# EAGLE design digidice_TI (EAGLE 6.2)
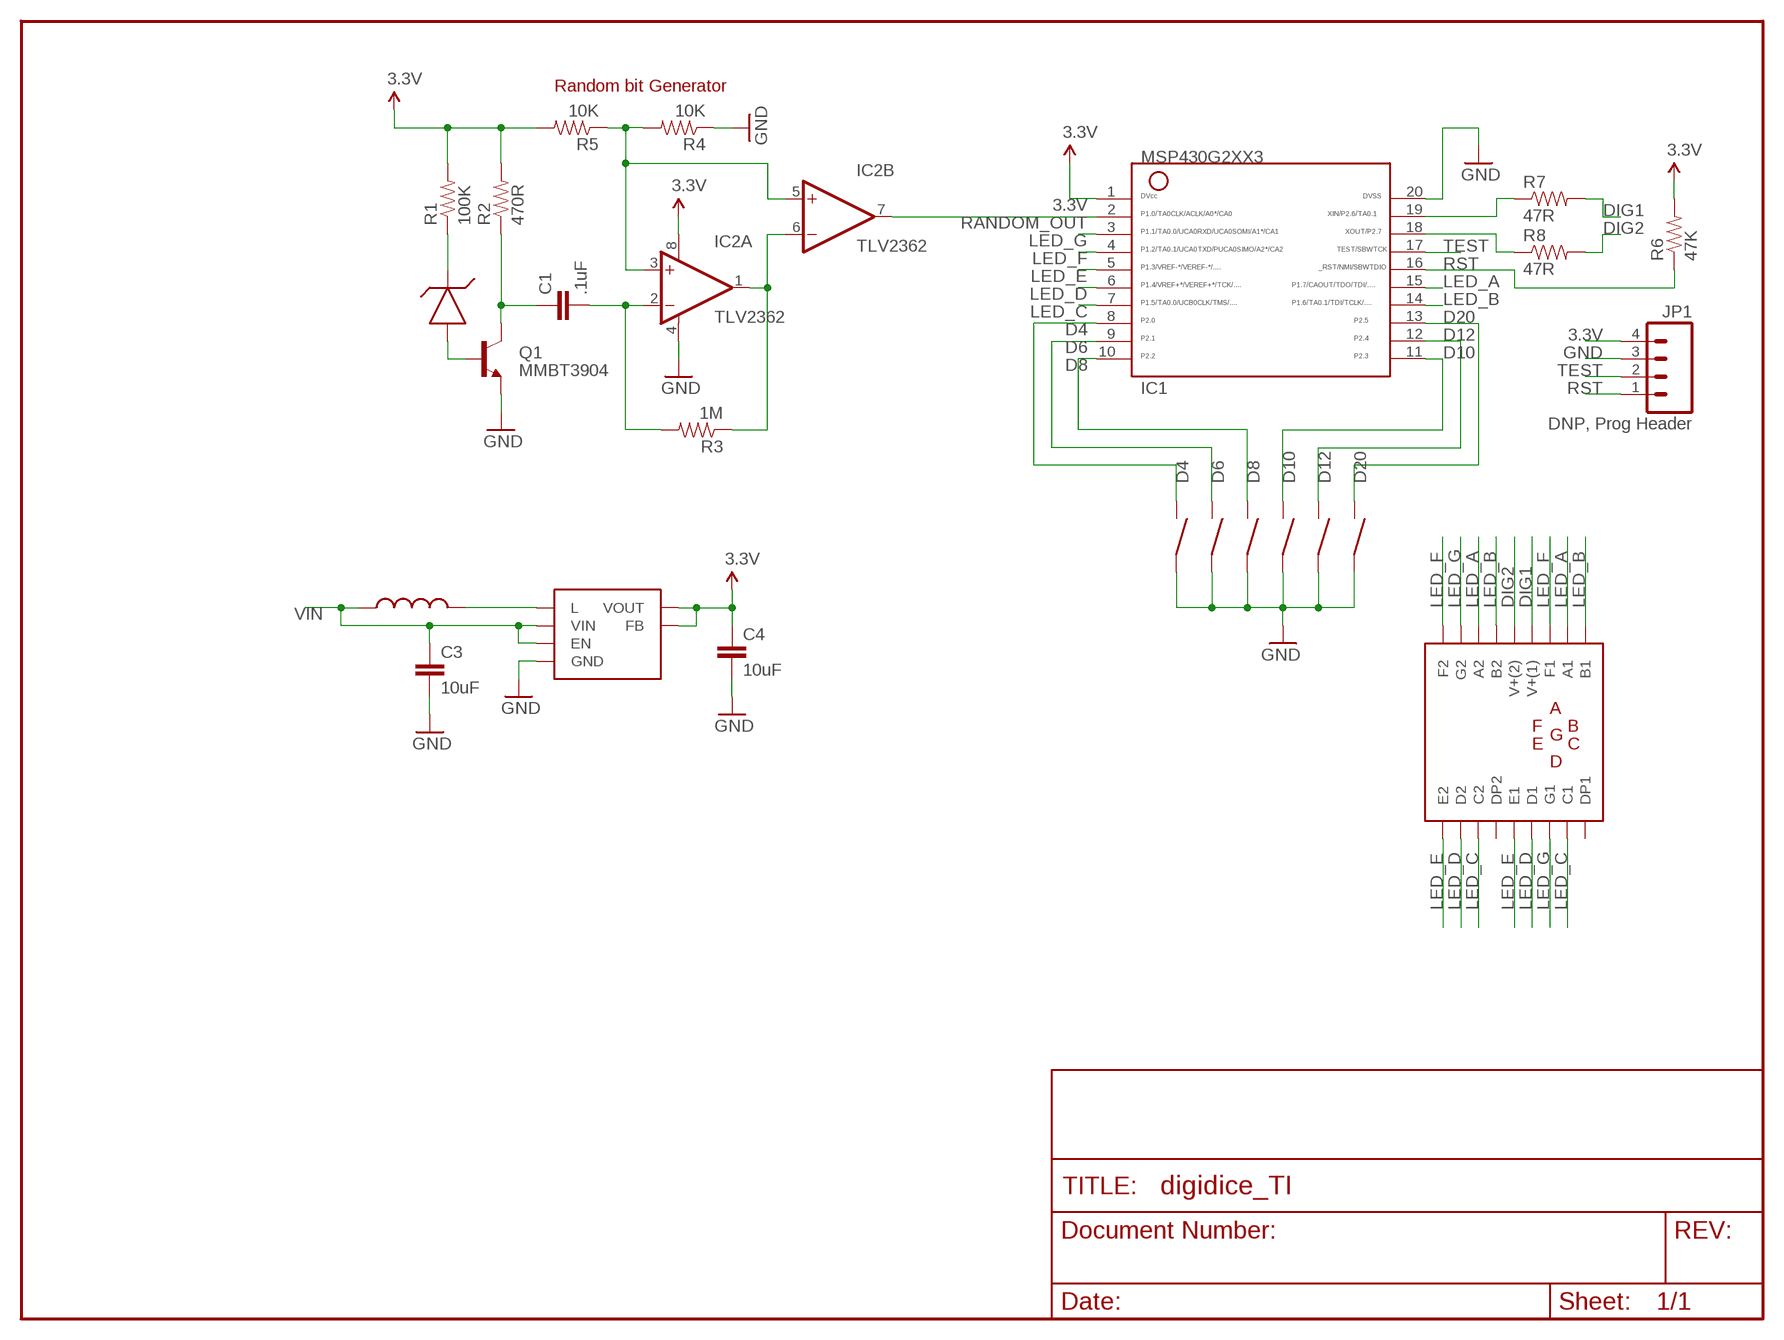
[diagram p0: schematic, sheet 1]

## Parts
C1  .1uF  CAP0402-CAP  [0402-CAP]
C3  10uF  CAP0603-CAP  [0603-CAP]
C4  10uF  CAP0603-CAP  [0603-CAP]
IC1  MSP430G2203IPW20  G2XX3---PW20  [PW20]
IC2  TLV2362  OPA2340E  [MSOP08]
IC3  TLV61225  [SOT-363]
JP1  DNP, Prog Header  M041.27MM  [1X04-1.27MM]
L1  PFL2015-472ML  INDUCTORPFL2015  [COILCRAFT-PFL2015]
Q1  MMBT3904  TRANSISTOR_NPNSOT23  [SOT23]
R1  100K  RESISTOR0402-RES  [0402-RES]
R2  470R  RESISTOR0402-RES  [0402-RES]
R3  1M  RESISTOR0402-RES  [0402-RES]
R4  10K  RESISTOR0402-RES  [0402-RES]
R5  10K  RESISTOR0402-RES  [0402-RES]
R6  47K  RESISTOR0402-RES  [0402-RES]
R7  47R  RESISTOR  [0805]
R8  47R  RESISTOR  [0805]
SW1  SPST_SWITCH  [EG2513-ND]
SW2  SPST_SWITCH  [EG2513-ND]
SW3  SPST_SWITCH  [EG2513-ND]
SW4  SPST_SWITCH  [EG2513-ND]
SW5  SPST_SWITCH  [EG2513-ND]
SW6  SPST_SWITCH  [EG2513-ND]
U$1  ZXRE1004FFTA  [SOT23]
U$2  2DIGIT_7SEGMENT  [HDSP-521E]

## Nets
3.3V: C4.1 IC1.1 IC2.8(A:V+) IC3.P$2(FB) IC3.P$4(VOUT) JP1.4 R1.2 R2.2 R5.2 R6.2
D4: IC1.8 SW6.P$2
D6: IC1.9 SW5.P$2
D8: IC1.10 SW4.P$2
D10: IC1.11 SW3.P$2
D12: IC1.12 SW2.P$2
D20: IC1.13 SW1.P$2
DIG1: R7.2 U$2.P$13(V+(1))
DIG2: R8.2 U$2.P$14(V+(2))
GND: C3.2 C4.2 IC1.20 IC2.4(A:V-) IC3.P$3(GND) JP1.3 Q1.2(E) R4.1 SW1.P$1 SW2.P$1 SW3.P$1 SW4.P$1 SW5.P$1 SW6.P$1
LED_A: IC1.15 U$2.P$11(A1) U$2.P$16(A2)
LED_B: IC1.14 U$2.P$10(B1) U$2.P$15(B2)
LED_C: IC1.7 U$2.P$3(C2) U$2.P$8(C1)
LED_D: IC1.6 U$2.P$2(D2) U$2.P$6(D1)
LED_E: IC1.5 U$2.P$1(E2) U$2.P$5(E1)
LED_F: IC1.4 U$2.P$12(F1) U$2.P$18(F2)
LED_G: IC1.3 U$2.P$7(G1) U$2.P$17(G2)
N$1: Q1.1(B) U$1.2(A)
N$2: C1.1 Q1.3(C) R2.1
N$3: R1.1 U$1.1(K)
N$4: C1.2 IC2.2(A:-IN) R3.2
N$5: IC2.1(A:OUT) IC2.6(B:-IN) R3.1
N$6: IC2.3(A:+IN) IC2.5(B:+IN) R4.2 R5.1
N$7: IC1.19 R7.1
N$10: IC1.18 R8.1
N$17: IC3.P$5(L) L1.P$2
RANDOM_OUT: IC1.2 IC2.7(B:OUT)
RST: IC1.16 JP1.1 R6.1
TEST: IC1.17 JP1.2
VIN: C3.1 IC3.P$1(VIN) IC3.P$6(EN) L1.P$1
Unconnected: U$2.P$4(DP2) U$2.P$9(DP1)

## Notes on the sheet
- Random bit Generator

## Library data of the parts
C1 C3 C4 = KippKitts:CAP: Capacitor Standard 0603 ceramic capacitor, and 0.1" leaded capacitor.
IC1 = TI_MSP430_v16:G2XX3---PW20: MSP430G2XX1 TSSOP (PW) 20 Pin Package
IC2 = burr-brown:OPA2340: Single-Supply, Rail-to-Rail Operational Amplifiers MicroAmplifier(TM) Series; Product Folder:OPA2340; MF: TEXAS INSTRUMENTS; MPN: OPA2340EA/250; OC_FARNELL: 1101540; OC_NEWARK: 36K7580
IC3 = KippKitts:TLV61225
JP1 = SparkFun:M04: Header 4 Standard 4-pin 0.1" header. Use with straight break away headers (SKU : PRT-00116), right angle break away headers (PRT-00553), swiss pins (PRT-00743), machine pins (PRT-00117), and female headers (PRT-00115). Molex polarized connector foot print use with SKU : PRT-08231 with associated crimp pins and housings. 1MM SMD Version SKU: PRT-10208
L1 = KippKitts:INDUCTOR
Q1 = SparkFun:TRANSISTOR_NPN: Transistor NPN BJT configuration in SOT23 package. MMBT2222 is the common NPN we use. Double check BCE configuration again layout.
R1-R8 = KippKitts:RESISTOR: Resistor Basic schematic elements and footprints for 0603, 1206, and PTH 1/10th watt (small) resistors.
SW1-SW6 = hjohnson_library:SPST_SWITCH
U$1 = hjohnson_library:ZXRE1004FFTA
U$2 = hjohnson_library:2DIGIT_7SEGMENT

## Board
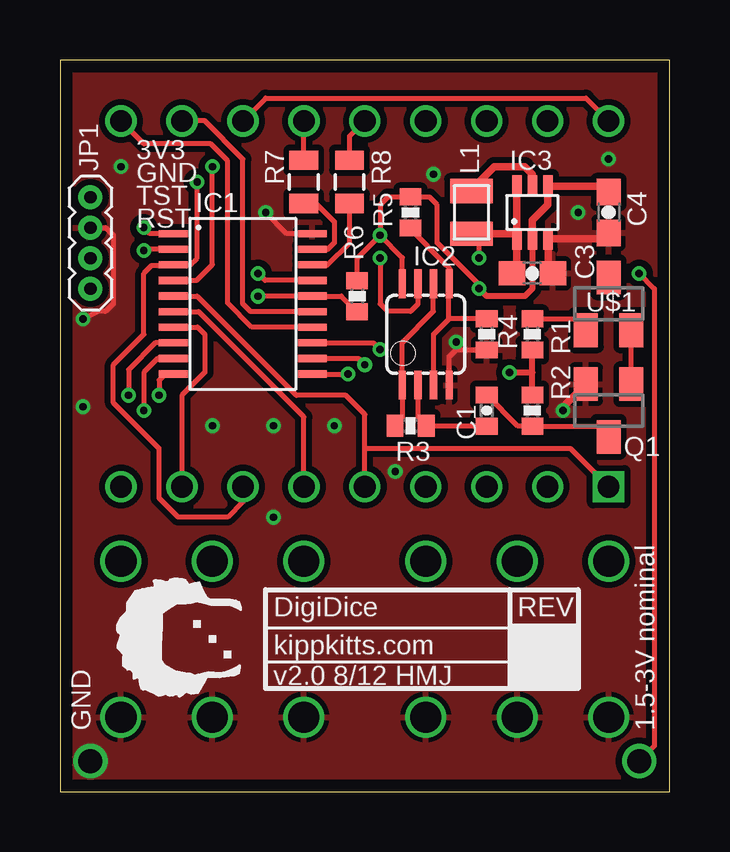
[diagram p1: board, top side]
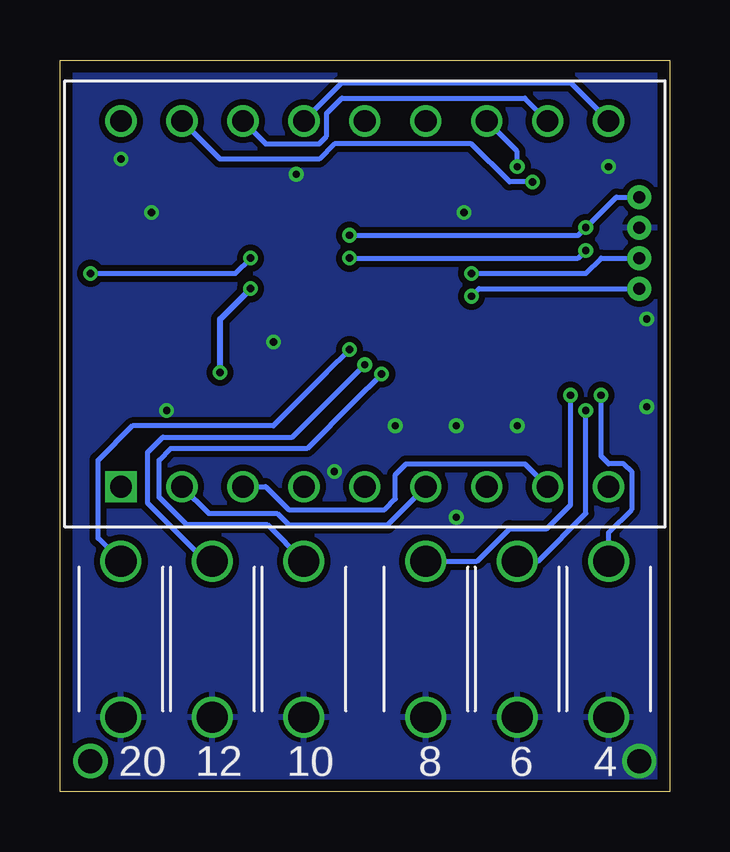
[diagram p2: board, bottom side, seen from below]

Size 25.4 x 30.48 mm. Coordinates in mm from the lower left corner, seen from the top.
Outline: 0,30.48 0,0 25.4,0 25.4,30.48 0,30.48
Copper layers (1*16): Top 0.035mm / dielectric 1.5mm / Bottom 0.035mm
Design rules: minimum track width 6mil, minimum drill 12mil, track to track 6mil, track to pad 6mil, pad to pad 6mil, via to via 6mil, smd to smd 6mil, copper to edge 20mil, drill to drill 8mil, minimum pad ring 8mil, minimum via ring 6mil, stop-mask expansion 3mil, vias tented up to drill 0mil, thermal gap 8mil

### Footprints (pad centres in the part's own frame; a part is rotated, then mirrored left to right if it is on the bottom)
0402-CAP = smd 0.7 x 0.9: 1 -0.65,0; 2 0.65,0
0603-CAP = smd 1.1 x 1: 1 -0.85,0; 2 0.85,0
PW20 = smd 0.3 x 1.2: 1 -2.925,-2.9; 2 -2.275,-2.9; 3 -1.625,-2.9; 4 -0.975,-2.9; 5 -0.325,-2.9; 6 0.325,-2.9; 7 0.975,-2.9; 8 1.625,-2.9; 9 2.275,-2.9; 10 2.925,-2.9; 11 2.925,2.9; 12 2.275,2.9; 13 1.625,2.9; 14 0.975,2.9; 15 0.325,2.9; 16 -0.325,2.9; 17 -0.975,2.9; 18 -1.625,2.9; 19 -2.275,2.9; 20 -2.925,2.9
MSOP08 = smd 0.3 x 1.2: 1 -0.976,-2.113; 2 -0.326,-2.113; 3 0.324,-2.113; 4 0.974,-2.113; 5 0.974,2.112; 6 0.324,2.112; 7 -0.326,2.112; 8 -0.976,2.112
SOT-363 = smd 0.4 x 0.9: P$1 -0.65,-1.1; P$2 0,-1.1; P$3 0.65,-1.1; P$4 0.65,1.1; P$5 0,1.1; P$6 -0.65,1.1
1X04-1.27MM = drill 0.508 pad 1: 1 0,0; 2 1.27,0; 3 2.54,0; 4 3.81,0
COILCRAFT-PFL2015 = smd 1.016 x 1.778: P$1 -0.889,0; P$2 0.889,0
SOT23 = smd 1 x 1.4: 1 -0.95,-1.1; 2 0.95,-1.1; 3 0,1.1
0402-RES = smd 0.7 x 0.9: 1 -0.65,0; 2 0.65,0
0805 = smd 0.8 x 1.2: 1 -0.9,0; 2 0.9,0
EG2513-ND = drill 1.3: P$1 -3.25,0; P$2 3.25,0
HDSP-521E = drill 0.9 square: P$1 -10.16,-7.62 | drill 0.9: P$2 -7.62,-7.62; P$3 -5.08,-7.62; P$4 -2.54,-7.62; P$5 0,-7.62; P$6 2.54,-7.62; P$7 5.08,-7.62; P$8 7.62,-7.62; P$9 10.16,-7.62; P$10 10.16,7.62; P$11 7.62,7.62; P$12 5.08,7.62; P$13 2.54,7.62; P$14 0,7.62; P$15 -2.54,7.62; P$16 -5.08,7.62; P$17 -7.62,7.62; P$18 -10.16,7.62

### Placement (x,y rotation side)
C1  17.78,15.88 270 top
C3  19.68,21.59 0 top
C4  22.86,24.13 270 top
IC1  7.62,20.32 270 top
IC2  15.24,19.05 0 top
IC3  19.68,24.13 0 top
JP1  1.27,20.95 90 top
L1  17.14,24.13 90 top
Q1  22.86,15.88 180 top
R1  19.68,19.05 270 top
R2  19.68,15.88 90 top
R3  14.61,15.24 0 top
R4  17.78,19.05 90 top
R5  14.61,24.13 90 top
R6  12.38,20.64 90 top
R7  10.16,25.4 90 top
R8  12.06,25.4 90 top
SW1  22.86,6.35 90 bottom
SW2  19.05,6.35 90 bottom
SW3  15.24,6.35 90 bottom
SW4  10.16,6.35 90 bottom
SW5  6.35,6.35 90 bottom
SW6  2.54,6.35 90 bottom
U$1  22.86,20.32 0 top
U$2  12.7,20.32 0 bottom
U$3  [TOP_DOCU_5MM]  8.26,3.17 90 top

### Tracks (layer width: path | path; a pad name or v marks a point on that pad's centre or on a via)
3.3V  (via drill 0.3)
  Top 0.203: IC1.1 3.74,23.25 v3.49,23.5 | v13.35,23.19 v13.34,23.18 | R6.2 12.38,22.23 v13.34,23.18 | IC2.8 14.26,22.25 v13.34,23.18 | v13.34,23.18 13.34,24.45 13.65,24.77 14.59,24.77 R5.2 14.62,24.77 15.4,24.77 15.72,24.45 15.72,22.86 17.46,21.11 v17.46,20.95
  Top 0.254: IC3.P$2 19.68,20.95 19.37,20.64 17.78,20.64 v17.46,20.95 | R2.2 19.68,17.46 | 19.68,17.46 R1.2 | v18.73,17.46 19.68,17.46
  Top 0.305: IC3.P$2 19.68,23.81 20.32,24.45 20.32,25.21 IC3.P$4 22.54,25.23 C4.1
  Bottom 0.203: v13.34,23.18 3.81,23.18 v3.49,23.5 2.22,24.77 JP1.4
  Bottom 0.254: v18.73,17.46 18.73,19.68 v17.46,20.95
D4  (via drill 0.3)
  Top 0.203: IC1.8 3.97,18.7 2.86,17.58 v2.86,16.51
  Bottom 0.203: SW6.P$2 2.54,10.79 1.59,11.75 1.59,13.34 1.91,13.65 2.54,13.65 2.86,13.97 v2.86,16.51
D6  (via drill 0.3)
  Top 0.203: IC1.9 4.08,18.05 3.49,17.46 v3.49,15.88
  Bottom 0.203: SW5.P$2 5.48,9.6 3.49,11.59 v3.49,15.88
D8  (via drill 0.3)
  Top 0.203: IC1.10 4.38,17.39 4.13,17.14 v4.13,16.51
  Bottom 0.203: v4.13,16.51 4.13,11.94 5.11,10.95 6.67,10.95 8.02,9.6 SW4.P$2
D10  (via drill 0.3)
  Top 0.203: IC1.11 v12,17.39
  Bottom 0.203: SW3.P$2 16.75,11.11 20.13,11.11 21.27,12.26 21.27,13.81 20.8,14.29 15.11,14.29 13.18,16.22 v12,17.39
D12  (via drill 0.3)
  Top 0.203: IC1.12 12.44,18.05 v12.7,17.78
  Bottom 0.203: v12.7,17.78 13.65,16.83 15.72,14.76 21.11,14.76 21.75,14.13 21.75,12.02 19.33,9.6 SW2.P$2
D20  (via drill 0.3)
  Top 0.203: IC1.13 13.05,18.7 v13.34,18.41
  Bottom 0.203: v13.34,18.41 14.29,17.46 16.51,15.24 22.38,15.24 23.81,13.81 23.81,10.55 SW1.P$2
DIG1
  Top 0.203: R7.2 U$2.P$13
DIG2
  Top 0.203: R8.2 12.06,27.3 U$2.P$14
GND  (via drill 0.3, 1 pad 1.42)
  Top 0.203: IC2.4 16.21,18.12 16.51,18.41 17.77,18.41 R4.1 | JP1.3 1.91,23.5 2.22,23.18 2.22,20.32 1.91,20 1.59,20 v0.95,19.68 | IC1.20 9.46,23.25 v8.57,24.13
  Top 0.305: C3.2 20.34,21.84 IC3.P$3 22.66,23.03 C4.2 | v20.95,15.88 20.95,16.02 Q1.2
  other vias: 1.27,1.27 11.43,15.24 16.51,18.73 0.95,16.03 6.35,15.24 8.89,11.43 21.59,24.13 15.56,25.72 2.54,26.04 22.86,26.35 13.97,13.34 8.89,15.24
  pour Bottom (isolate 0.254): -2.54,33.02 27.94,33.02 27.94,-2.54 -2.54,-2.54
  pour Top (isolate 0.254): -1.27,31.75 -1.27,-1.27 26.67,-1.27 26.67,31.75
LED_A
  Top 0.203: IC1.15 7.95,20 7.62,20.32 7.62,26.35 6.03,27.94 U$2.P$11
  Bottom 0.203: U$2.P$16 16.83,26.99 14.61,26.99 14.29,27.3 14.29,28.26 13.65,28.89 6.03,28.89 U$2.P$11
LED_B
  Top 0.203: IC1.14 8,19.34 6.99,20.36 6.99,26.28 6.28,26.99 3.49,26.99 U$2.P$10
  Bottom 0.203: U$2.P$15 13.65,29.53 4.13,29.53 U$2.P$10
LED_C
  Top 0.203: U$2.P$8 5.08,16.51 6.03,17.46 6.03,19.05 5.74,19.34 IC1.7
  Bottom 0.203: U$2.P$8 6.03,13.65 10.98,13.65 11.43,13.2 11.43,12.2 11.88,11.75 15.88,11.75 16.83,12.7 U$2.P$3
LED_D
  Top 0.203: IC1.6 5.78,20 10.16,15.61 U$2.P$6
  Bottom 0.203: U$2.P$2 19.21,11.59 16.35,11.59 15.88,11.11 11.75,11.11 U$2.P$6
LED_E
  Top 0.203: IC1.5 5.71,20.64 7.3,19.05 9.84,16.51 11.91,16.51 12.7,15.72 12.7,14.29 | U$2.P$1 21.27,14.29 12.7,14.29 | U$2.P$5 12.7,14.29
LED_F  (via drill 0.3)
  Top 0.203: IC1.4 5.69,21.3 6.35,21.95 v6.35,26.04 | U$2.P$18 21.91,28.89 8.57,28.89 U$2.P$12
  Bottom 0.203: v6.35,26.04 6.35,26.67 U$2.P$12
LED_G  (via drill 0.3)
  Top 0.203: U$2.P$7 7.62,12.06 6.99,11.43 4.92,11.43 4.13,12.22 4.13,14.29 2.22,16.19 2.22,17.78 3.49,19.05 3.49,21.59 3.81,21.91 4.68,21.91 IC1.3 5.43,21.95 5.71,22.23 v5.71,25.4
  Bottom 0.203: v5.71,25.4 6.67,25.4 8.26,26.99 13.97,26.99 14.61,26.35 18.73,26.35 U$2.P$17
N$1
  Top 0.203: Q1.1 U$1.2
N$2
  Top 0.203: 22.68,14.59 Q1.3 22.41,15.22 R2.1 19.08,15.22 C1.1
N$3
  Top 0.203: R1.1 21.91,19.7 U$1.1
N$4
  Top 0.203: IC2.2 14.91,15.58 R3.2 17.77,15.24 C1.2
N$5
  Top 0.203: IC2.6 15.56,20 14.26,18.71 IC2.1 14.26,15.55 R3.1
N$6
  Top 0.203: IC2.3 15.56,19.06 16.19,19.68 | 16.19,19.68 16.19,21.14 IC2.5 16.24,21.18 16.24,21.8 16,22.04 14.61,23.43 R5.1 | R4.2 16.21,19.7 16.19,19.68
N$7
  Top 0.203: R7.1 10.67,24.5 11.43,23.74 11.43,22.86 11.16,22.59 IC1.19
N$10
  Top 0.203: IC1.18 11.14,21.95 12.06,22.87 R8.1
N$17
  Top 0.305: L1.P$2 17.14,25.08 18.1,26.04 19.37,26.04 19.68,25.72 IC3.P$5
RANDOM_OUT  (via drill 0.3)
  Top 0.203: IC1.2 3.54,22.59 v3.49,22.54 | IC2.7 14.91,20.31 14.61,20 13.65,20 13.34,20.32 v13.34,22.23
  Bottom 0.203: v13.34,22.23 3.81,22.23 v3.49,22.54
RST  (via drill 0.3)
  Top 0.203: R6.1 11.72,20.64 IC1.16 v8.26,20.64
  Bottom 0.203: JP1.1 7.94,20.95 v8.26,20.64
TEST  (via drill 0.3)
  Top 0.203: IC1.17 8.55,21.3 v8.26,21.59
  Bottom 0.203: v8.26,21.59 3.49,21.59 2.86,22.23 JP1.2
VIN  (via drill 0.3, 1 pad 1.42)
  Top 0.203: v17.46,22.23 17.46,22.92 L1.P$1 | v24.13,21.59 24.77,20.95 24.77,1.91 v24.13,1.27
  Top 0.305: IC3.P$1 IC3.P$6 | L1.P$1 19.04,23.24 IC3.P$1 | IC3.P$1 19.04,21.84 C3.1
  Bottom 0.203: v24.13,21.59 18.1,21.59 v17.46,22.23

### Text on the board
tPlace: 3V3 | GND | TST | RST | DigiDice | REV | kippkitts.com | v2.0 8/12 HMJ | GND | 1.5-3V nominal
bPlace: 10 | 12 | 20 | 4 | 6 | 8